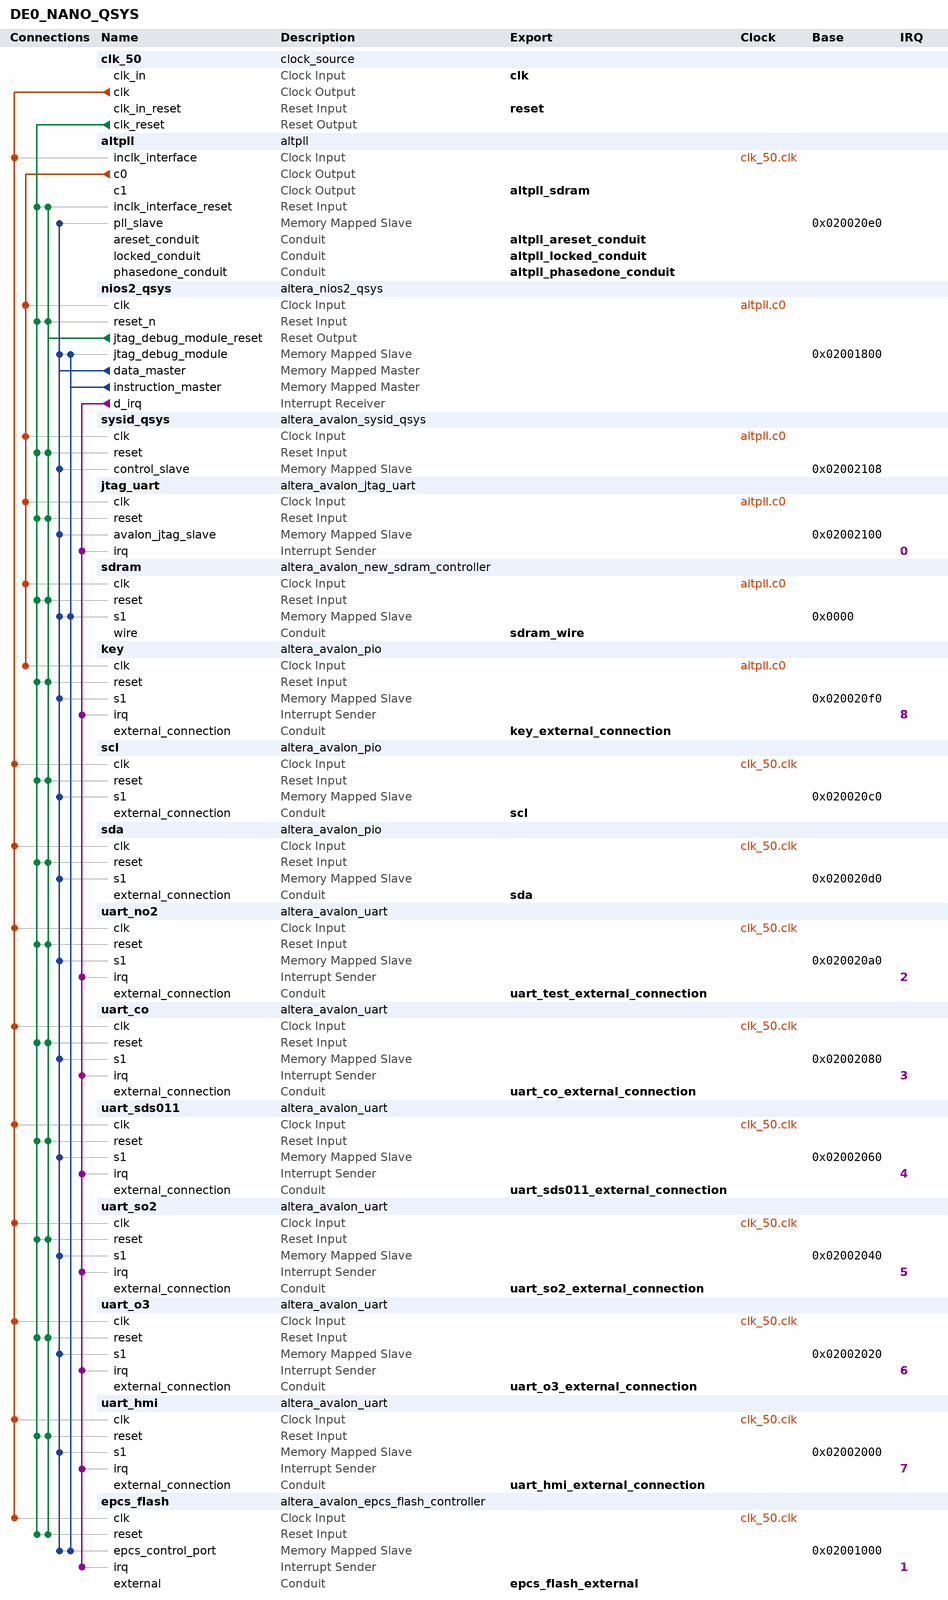
[diagram p0: system contents]
# Platform Designer (Qsys) system DE0_NANO_QSYS, Cyclone IV E EP4CE22F17C6
# Parameters at their usual value, and those the tool derives, are not listed.
package require -exact qsys 13.1
create_system DE0_NANO_QSYS
set_project_property DEVICE_FAMILY {Cyclone IV E}
set_project_property DEVICE EP4CE22F17C6

add_instance clk_50 clock_source 13.1
set_instance_parameter_value clk_50 clockFrequency 50000000

add_instance altpll altpll 13.1
set_instance_parameter_value altpll INCLK0_INPUT_FREQUENCY 20000
set_instance_parameter_value altpll CLK0_MULTIPLY_BY 2
set_instance_parameter_value altpll CLK1_MULTIPLY_BY 2
set_instance_parameter_value altpll CLK0_DIVIDE_BY 1
set_instance_parameter_value altpll CLK1_DIVIDE_BY 1
set_instance_parameter_value altpll CLK1_PHASE_SHIFT -1667
set_instance_parameter_value altpll CLK1_DUTY_CYCLE 50
set_instance_parameter_value altpll PORT_clk1 PORT_USED
set_instance_parameter_value altpll PORT_clk2 PORT_UNUSED
set_instance_parameter_value altpll PORT_clk3 PORT_UNUSED
set_instance_parameter_value altpll PORT_ARESET PORT_USED
set_instance_parameter_value altpll PORT_LOCKED PORT_USED

add_instance nios2_qsys altera_nios2_qsys 13.1
set_instance_parameter_value nios2_qsys resetSlave epcs_flash.epcs_control_port
set_instance_parameter_value nios2_qsys mmu_TLBMissExcSlave None
set_instance_parameter_value nios2_qsys exceptionSlave sdram.s1
set_instance_parameter_value nios2_qsys breakSlave nios2_qsys.jtag_debug_module
set_instance_parameter_value nios2_qsys impl Fast
set_instance_parameter_value nios2_qsys icache_size 4096

add_instance sysid_qsys altera_avalon_sysid_qsys 13.1
set_instance_parameter_value sysid_qsys id 0

add_instance jtag_uart altera_avalon_jtag_uart 13.1
set_instance_parameter_value jtag_uart simInteractiveOptions NO_INTERACTIVE_WINDOWS

add_instance sdram altera_avalon_new_sdram_controller 13.1
set_instance_parameter_value sdram TAC 5.5
set_instance_parameter_value sdram TRCD 20.0
set_instance_parameter_value sdram TRP 20.0
set_instance_parameter_value sdram casLatency 3
set_instance_parameter_value sdram columnWidth 9
set_instance_parameter_value sdram dataWidth 16
set_instance_parameter_value sdram generateSimulationModel true
set_instance_parameter_value sdram model single_Micron_MT48LC4M32B2_7_chip
set_instance_parameter_value sdram numberOfBanks 4
set_instance_parameter_value sdram numberOfChipSelects 1
set_instance_parameter_value sdram powerUpDelay 100.0
set_instance_parameter_value sdram refreshPeriod 15.625
set_instance_parameter_value sdram rowWidth 13

add_instance key altera_avalon_pio 13.1
set_instance_parameter_value key captureEdge true
set_instance_parameter_value key direction Input
set_instance_parameter_value key edgeType FALLING
set_instance_parameter_value key generateIRQ true
set_instance_parameter_value key irqType EDGE
set_instance_parameter_value key width 1

add_instance scl altera_avalon_pio 13.1
set_instance_parameter_value scl direction Output
set_instance_parameter_value scl width 1

add_instance sda altera_avalon_pio 13.1
set_instance_parameter_value sda direction Bidir
set_instance_parameter_value sda width 1

add_instance uart_no2 altera_avalon_uart 13.1
set_instance_parameter_value uart_no2 baud 9600
set_instance_parameter_value uart_no2 dataBits 8
set_instance_parameter_value uart_no2 fixedBaud true
set_instance_parameter_value uart_no2 parity NONE
set_instance_parameter_value uart_no2 stopBits 1

add_instance uart_co altera_avalon_uart 13.1
set_instance_parameter_value uart_co baud 9600
set_instance_parameter_value uart_co dataBits 8
set_instance_parameter_value uart_co fixedBaud true
set_instance_parameter_value uart_co parity NONE
set_instance_parameter_value uart_co stopBits 1

add_instance uart_sds011 altera_avalon_uart 13.1
set_instance_parameter_value uart_sds011 baud 9600
set_instance_parameter_value uart_sds011 dataBits 8
set_instance_parameter_value uart_sds011 fixedBaud true
set_instance_parameter_value uart_sds011 parity NONE
set_instance_parameter_value uart_sds011 stopBits 1

add_instance uart_so2 altera_avalon_uart 13.1
set_instance_parameter_value uart_so2 baud 9600
set_instance_parameter_value uart_so2 dataBits 8
set_instance_parameter_value uart_so2 fixedBaud true
set_instance_parameter_value uart_so2 parity NONE
set_instance_parameter_value uart_so2 stopBits 1

add_instance uart_o3 altera_avalon_uart 13.1
set_instance_parameter_value uart_o3 baud 9600
set_instance_parameter_value uart_o3 dataBits 8
set_instance_parameter_value uart_o3 fixedBaud true
set_instance_parameter_value uart_o3 parity NONE
set_instance_parameter_value uart_o3 stopBits 1

add_instance uart_hmi altera_avalon_uart 13.1
set_instance_parameter_value uart_hmi baud 115200
set_instance_parameter_value uart_hmi dataBits 8
set_instance_parameter_value uart_hmi fixedBaud true
set_instance_parameter_value uart_hmi parity NONE
set_instance_parameter_value uart_hmi stopBits 1

add_instance epcs_flash altera_avalon_epcs_flash_controller 13.1

# connections
add_connection altpll.c0 jtag_uart.clk clock
add_connection altpll.c0 key.clk clock
add_connection altpll.c0 nios2_qsys.clk clock
add_connection altpll.c0 sdram.clk clock
add_connection altpll.c0 sysid_qsys.clk clock
add_connection clk_50.clk altpll.inclk_interface clock
add_connection clk_50.clk epcs_flash.clk clock
add_connection clk_50.clk scl.clk clock
add_connection clk_50.clk sda.clk clock
add_connection clk_50.clk uart_co.clk clock
add_connection clk_50.clk uart_hmi.clk clock
add_connection clk_50.clk uart_no2.clk clock
add_connection clk_50.clk uart_o3.clk clock
add_connection clk_50.clk uart_sds011.clk clock
add_connection clk_50.clk uart_so2.clk clock
add_connection clk_50.clk_reset altpll.inclk_interface_reset reset
add_connection clk_50.clk_reset epcs_flash.reset reset
add_connection clk_50.clk_reset jtag_uart.reset reset
add_connection clk_50.clk_reset key.reset reset
add_connection clk_50.clk_reset nios2_qsys.reset_n reset
add_connection clk_50.clk_reset scl.reset reset
add_connection clk_50.clk_reset sda.reset reset
add_connection clk_50.clk_reset sdram.reset reset
add_connection clk_50.clk_reset sysid_qsys.reset reset
add_connection clk_50.clk_reset uart_co.reset reset
add_connection clk_50.clk_reset uart_hmi.reset reset
add_connection clk_50.clk_reset uart_no2.reset reset
add_connection clk_50.clk_reset uart_o3.reset reset
add_connection clk_50.clk_reset uart_sds011.reset reset
add_connection clk_50.clk_reset uart_so2.reset reset
add_connection nios2_qsys.jtag_debug_module_reset altpll.inclk_interface_reset reset
add_connection nios2_qsys.jtag_debug_module_reset epcs_flash.reset reset
add_connection nios2_qsys.jtag_debug_module_reset jtag_uart.reset reset
add_connection nios2_qsys.jtag_debug_module_reset key.reset reset
add_connection nios2_qsys.jtag_debug_module_reset nios2_qsys.reset_n reset
add_connection nios2_qsys.jtag_debug_module_reset scl.reset reset
add_connection nios2_qsys.jtag_debug_module_reset sda.reset reset
add_connection nios2_qsys.jtag_debug_module_reset sdram.reset reset
add_connection nios2_qsys.jtag_debug_module_reset sysid_qsys.reset reset
add_connection nios2_qsys.jtag_debug_module_reset uart_co.reset reset
add_connection nios2_qsys.jtag_debug_module_reset uart_hmi.reset reset
add_connection nios2_qsys.jtag_debug_module_reset uart_no2.reset reset
add_connection nios2_qsys.jtag_debug_module_reset uart_o3.reset reset
add_connection nios2_qsys.jtag_debug_module_reset uart_sds011.reset reset
add_connection nios2_qsys.jtag_debug_module_reset uart_so2.reset reset
add_connection nios2_qsys.data_master altpll.pll_slave avalon
set_connection_parameter_value nios2_qsys.data_master/altpll.pll_slave baseAddress 0x020020e0
add_connection nios2_qsys.data_master epcs_flash.epcs_control_port avalon
set_connection_parameter_value nios2_qsys.data_master/epcs_flash.epcs_control_port baseAddress 0x02001000
add_connection nios2_qsys.data_master jtag_uart.avalon_jtag_slave avalon
set_connection_parameter_value nios2_qsys.data_master/jtag_uart.avalon_jtag_slave baseAddress 0x02002100
add_connection nios2_qsys.data_master key.s1 avalon
set_connection_parameter_value nios2_qsys.data_master/key.s1 baseAddress 0x020020f0
add_connection nios2_qsys.data_master nios2_qsys.jtag_debug_module avalon
set_connection_parameter_value nios2_qsys.data_master/nios2_qsys.jtag_debug_module baseAddress 0x02001800
add_connection nios2_qsys.data_master scl.s1 avalon
set_connection_parameter_value nios2_qsys.data_master/scl.s1 baseAddress 0x020020c0
add_connection nios2_qsys.data_master sda.s1 avalon
set_connection_parameter_value nios2_qsys.data_master/sda.s1 baseAddress 0x020020d0
add_connection nios2_qsys.data_master sdram.s1 avalon
set_connection_parameter_value nios2_qsys.data_master/sdram.s1 baseAddress 0x0000
add_connection nios2_qsys.data_master sysid_qsys.control_slave avalon
set_connection_parameter_value nios2_qsys.data_master/sysid_qsys.control_slave baseAddress 0x02002108
add_connection nios2_qsys.data_master uart_co.s1 avalon
set_connection_parameter_value nios2_qsys.data_master/uart_co.s1 baseAddress 0x02002080
add_connection nios2_qsys.data_master uart_hmi.s1 avalon
set_connection_parameter_value nios2_qsys.data_master/uart_hmi.s1 baseAddress 0x02002000
add_connection nios2_qsys.data_master uart_no2.s1 avalon
set_connection_parameter_value nios2_qsys.data_master/uart_no2.s1 baseAddress 0x020020a0
add_connection nios2_qsys.data_master uart_o3.s1 avalon
set_connection_parameter_value nios2_qsys.data_master/uart_o3.s1 baseAddress 0x02002020
add_connection nios2_qsys.data_master uart_sds011.s1 avalon
set_connection_parameter_value nios2_qsys.data_master/uart_sds011.s1 baseAddress 0x02002060
add_connection nios2_qsys.data_master uart_so2.s1 avalon
set_connection_parameter_value nios2_qsys.data_master/uart_so2.s1 baseAddress 0x02002040
add_connection nios2_qsys.instruction_master epcs_flash.epcs_control_port avalon
set_connection_parameter_value nios2_qsys.instruction_master/epcs_flash.epcs_control_port baseAddress 0x02001000
add_connection nios2_qsys.instruction_master nios2_qsys.jtag_debug_module avalon
set_connection_parameter_value nios2_qsys.instruction_master/nios2_qsys.jtag_debug_module baseAddress 0x02001800
add_connection nios2_qsys.instruction_master sdram.s1 avalon
set_connection_parameter_value nios2_qsys.instruction_master/sdram.s1 baseAddress 0x0000
add_connection nios2_qsys.d_irq epcs_flash.irq interrupt
set_connection_parameter_value nios2_qsys.d_irq/epcs_flash.irq irqNumber 1
add_connection nios2_qsys.d_irq jtag_uart.irq interrupt
set_connection_parameter_value nios2_qsys.d_irq/jtag_uart.irq irqNumber 0
add_connection nios2_qsys.d_irq key.irq interrupt
set_connection_parameter_value nios2_qsys.d_irq/key.irq irqNumber 8
add_connection nios2_qsys.d_irq uart_co.irq interrupt
set_connection_parameter_value nios2_qsys.d_irq/uart_co.irq irqNumber 3
add_connection nios2_qsys.d_irq uart_hmi.irq interrupt
set_connection_parameter_value nios2_qsys.d_irq/uart_hmi.irq irqNumber 7
add_connection nios2_qsys.d_irq uart_no2.irq interrupt
set_connection_parameter_value nios2_qsys.d_irq/uart_no2.irq irqNumber 2
add_connection nios2_qsys.d_irq uart_o3.irq interrupt
set_connection_parameter_value nios2_qsys.d_irq/uart_o3.irq irqNumber 6
add_connection nios2_qsys.d_irq uart_sds011.irq interrupt
set_connection_parameter_value nios2_qsys.d_irq/uart_sds011.irq irqNumber 4
add_connection nios2_qsys.d_irq uart_so2.irq interrupt
set_connection_parameter_value nios2_qsys.d_irq/uart_so2.irq irqNumber 5

# exported interfaces
add_interface clk clock sink
set_interface_property clk EXPORT_OF clk_50.clk_in
add_interface reset reset sink
set_interface_property reset EXPORT_OF clk_50.clk_in_reset
add_interface key_external_connection conduit end
set_interface_property key_external_connection EXPORT_OF key.external_connection
add_interface sdram_wire conduit end
set_interface_property sdram_wire EXPORT_OF sdram.wire
add_interface altpll_sdram clock source
set_interface_property altpll_sdram EXPORT_OF altpll.c1
add_interface altpll_areset_conduit conduit end
set_interface_property altpll_areset_conduit EXPORT_OF altpll.areset_conduit
add_interface altpll_locked_conduit conduit end
set_interface_property altpll_locked_conduit EXPORT_OF altpll.locked_conduit
add_interface altpll_phasedone_conduit conduit end
set_interface_property altpll_phasedone_conduit EXPORT_OF altpll.phasedone_conduit
add_interface scl conduit end
set_interface_property scl EXPORT_OF scl.external_connection
add_interface sda conduit end
set_interface_property sda EXPORT_OF sda.external_connection
add_interface uart_test_external_connection conduit end
set_interface_property uart_test_external_connection EXPORT_OF uart_no2.external_connection
add_interface uart_co_external_connection conduit end
set_interface_property uart_co_external_connection EXPORT_OF uart_co.external_connection
add_interface uart_sds011_external_connection conduit end
set_interface_property uart_sds011_external_connection EXPORT_OF uart_sds011.external_connection
add_interface uart_so2_external_connection conduit end
set_interface_property uart_so2_external_connection EXPORT_OF uart_so2.external_connection
add_interface uart_o3_external_connection conduit end
set_interface_property uart_o3_external_connection EXPORT_OF uart_o3.external_connection
add_interface uart_hmi_external_connection conduit end
set_interface_property uart_hmi_external_connection EXPORT_OF uart_hmi.external_connection
add_interface epcs_flash_external conduit end
set_interface_property epcs_flash_external EXPORT_OF epcs_flash.external

set_interconnect_requirement {$system} qsys_mm.clockCrossingAdapter HANDSHAKE
set_interconnect_requirement {$system} qsys_mm.maxAdditionalLatency 1

save_system DE0_NANO_QSYS.qsys
